# Altium schematic sheet encoder.SchDoc
size A2
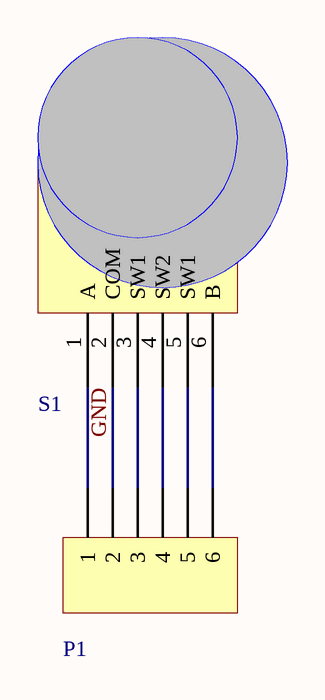
[diagram p0: encoder.SchDoc]

## Parts
P1  Header 6  [MX1.25-6P 접]  (value not drawn)
S1  버쫴긍쯤포  [버쫴긍쯤포]  (value not drawn)

## Nets
GND: P1.2 S1.2(COM)
NetP1_1: P1.1 S1.1(A)
NetP1_3: P1.3 S1.3(SW1)
NetP1_4: P1.4 S1.4(SW2)
NetP1_5: P1.5 S1.5(SW1)
NetP1_6: P1.6 S1.6(B)

## Library data of the parts
P1 = Header 6: Header, 6-Pin; LatestRevisionDate: 17-Jul-2002; LatestRevisionNote: Re-released for DXP Platform.; Publisher: Altium Limited